# EAGLE design twip-mb4 (EAGLE 9.3.0)
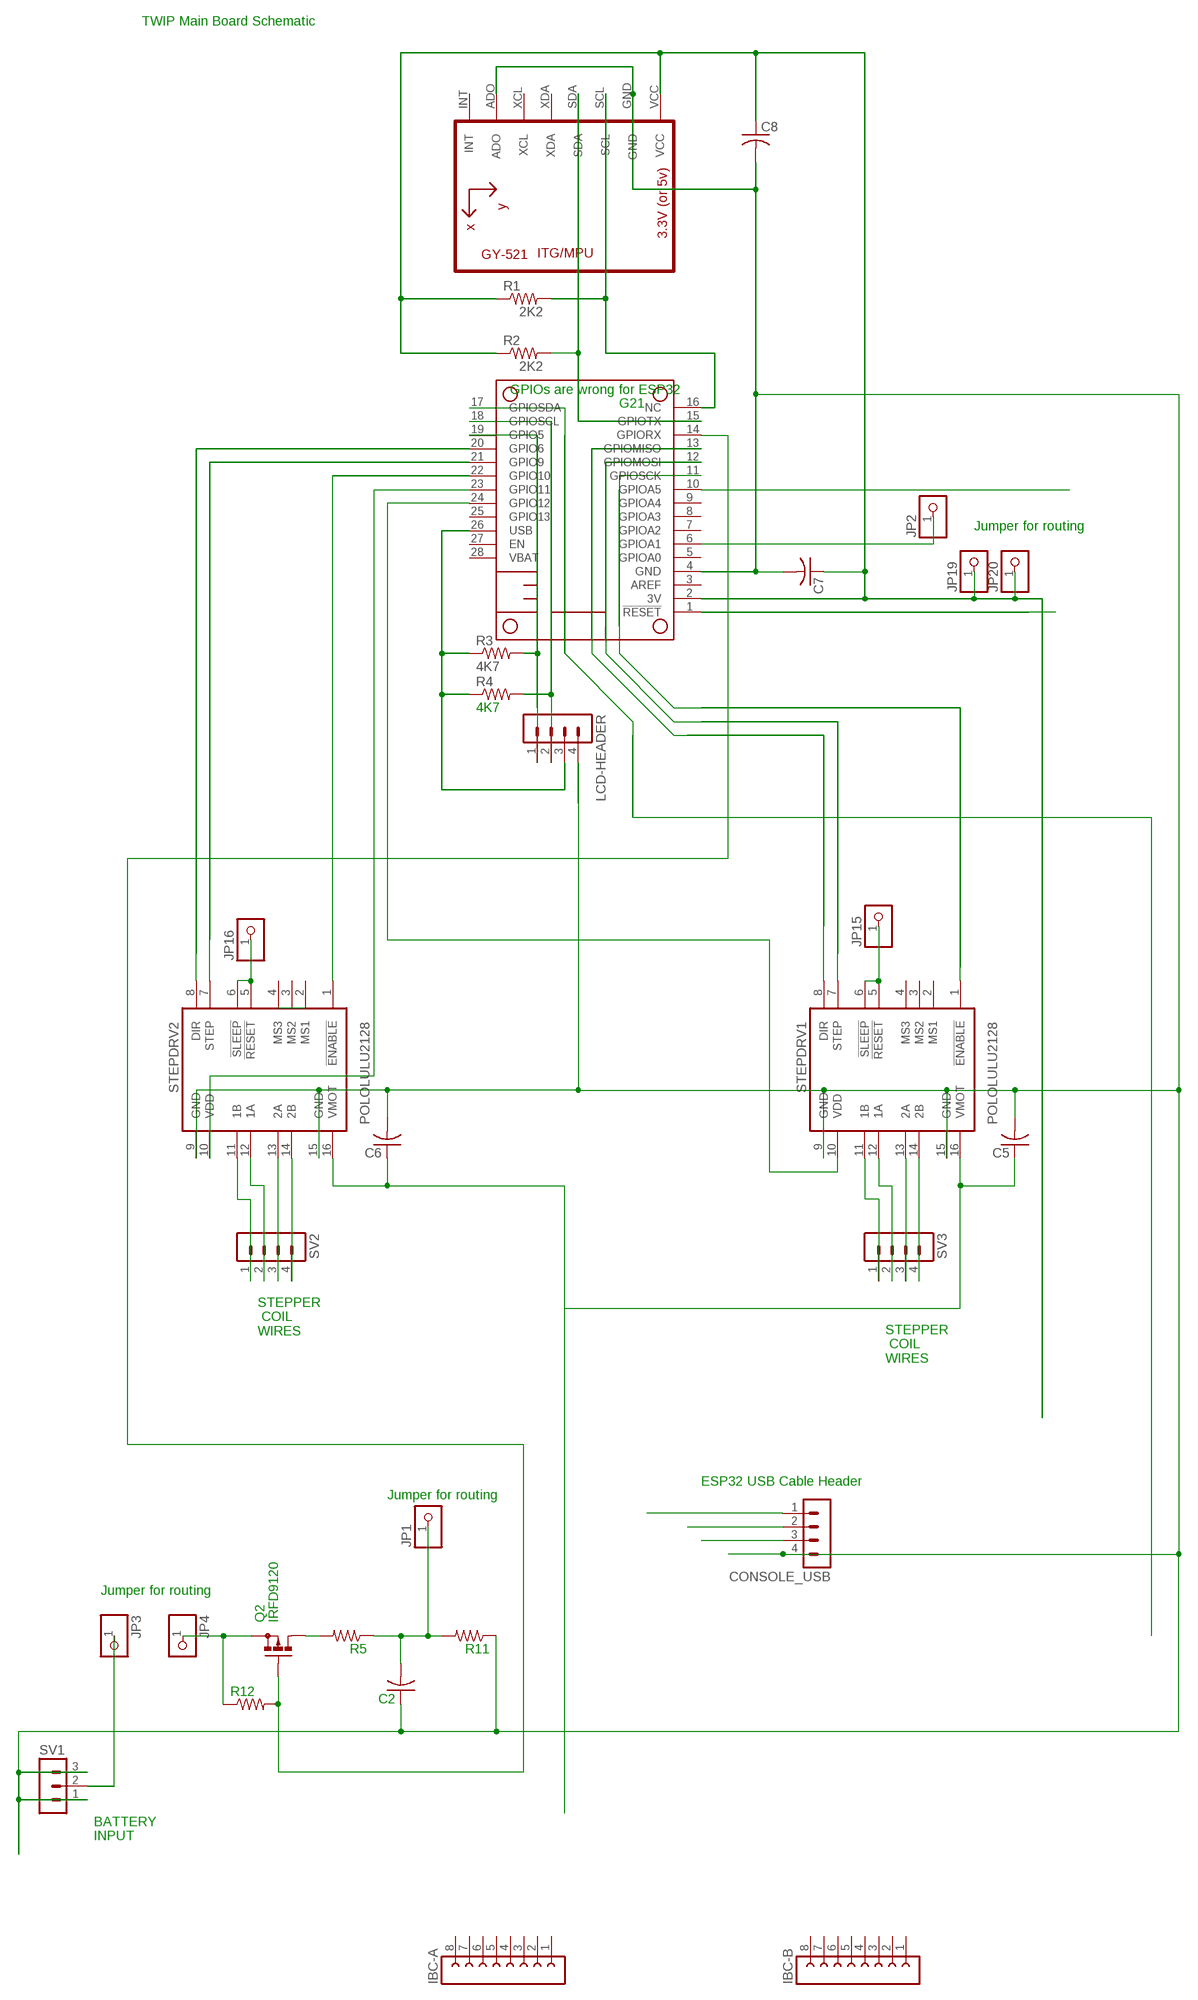
[diagram p0: schematic, sheet 1]

## Parts
C2  C-US050-025X075  [C050-025X075]
C5  C-US050-024X044  [C050-024X044]
C6  C-US050-024X044  [C050-024X044]
C7  C-US050-024X044  [C050-024X044]
C8  C-US050-024X044  [C050-024X044]
CONSOLE_USB  MA04-1  [MA04-1]
IBC-A  FE08-1  [FE08]
IBC-B  FE08-1  [FE08]
JP1  PINHD-1X1  [1X01]
JP2  PINHD-1X1  [1X01]
JP3  PINHD-1X1  [1X01]
JP4  PINHD-1X1  [1X01]
JP15  PINHD-1X1  [1X01]
JP16  PINHD-1X1  [1X01]
JP19  PINHD-1X1  [1X01]
JP20  PINHD-1X1  [1X01]
LCD-HEADER  MA04-1  [MA04-1]
MS2  FEATHERWING_NOHOLES  [FEATHERWING_NOHOLES]
Q2  IRFD9120  [C370-01]
R1  2K2  R-US_0309/12  [0309/12]
R2  2K2  R-US_0309/12  [0309/12]
R3  4K7  R-US_0309/12  [0309/12]
R4  4K7  R-US_0309/12  [0309/12]
R5  R-US_0207/10  [0207/10]
R11  R-US_0207/10  [0207/10]
R12  R-US_0207/10  [0207/10]
STEPDRV1  POLOLULU2128  [POLOLULU2128]
STEPDRV2  POLOLULU2128  [POLOLULU2128]
SV1  MA03-1  [MA03-1]
SV2  MA04-1  [MA04-1]
SV3  MA04-1  [MA04-1]
U1  GY-521MPU6050  [GY-521]

## Nets
3V: C7.1 C8.1 JP19.1 JP20.1 MS2.2(3V) R1.1 R2.1 U1.VCC
N$2: C5.1 STEPDRV1.16(VMOT)
N$3: MS2.13(GPIOMISO) STEPDRV1.8(DIR)
N$4: MS2.1(!RESET)
N$5: JP15.1 STEPDRV1.5(!RESET) STEPDRV1.6(!SLEEP)
N$6: MS2.14(GPIORX) Q2.G R12.2
N$7: JP16.1 STEPDRV2.5(!RESET) STEPDRV2.6(!SLEEP)
N$8: STEPDRV2.14(2B) SV2.4
N$9: C2.1 C5.2 C6.2 C7.2 C8.2 CONSOLE_USB.4 LCD-HEADER.4 MS2.4(GND) R11.1 STEPDRV1.9(GND) STEPDRV1.15(GND) STEPDRV2.9(GND) STEPDRV2.15(GND) SV1.1 SV1.3 U1.ADO U1.GND
N$11: LCD-HEADER.1 MS2.19(GPIO5) R3.2
N$12: STEPDRV2.13(2A) SV2.3
N$13: STEPDRV2.12(1A) SV2.2
N$14: STEPDRV2.11(1B) SV2.1
N$15: MS2.12(GPIOMOSI) STEPDRV1.7(STEP)
N$16: STEPDRV1.14(2B) SV3.4
N$17: MS2.16(NC) R1.2 U1.SCL
N$18: STEPDRV1.13(2A) SV3.3
N$19: STEPDRV1.12(1A) SV3.2
N$20: STEPDRV1.11(1B) SV3.1
N$21: MS2.11(GPIOSCK) STEPDRV1.1(!ENABLE)
N$22: CONSOLE_USB.2
N$23: CONSOLE_USB.3
N$24: JP4.1 Q2.S R12.1
N$25: MS2.15(GPIOTX) R2.2 U1.SDA
N$27: MS2.20(GPIO6) STEPDRV2.8(DIR)
N$28: MS2.17(GPIOSDA)
N$29: MS2.21(GPIO9) STEPDRV2.7(STEP)
N$30: C2.2 JP1.1 R5.1 R11.2
N$31: MS2.10(GPIOA5)
N$32: JP3.1 SV1.2
N$33: JP2.1 MS2.6(GPIOA1)
N$34: MS2.22(GPIO10) STEPDRV2.1(!ENABLE)
N$35: LCD-HEADER.2 MS2.18(GPIOSCL) R4.2
N$36: MS2.23(GPIO11) STEPDRV2.10(VDD)
N$37: MS2.24(GPIO12) STEPDRV1.10(VDD)
N$38: C6.1 STEPDRV2.16(VMOT)
N$48: CONSOLE_USB.1
N$51: Q2.D Q2.D1(D) R5.2
USB: LCD-HEADER.3 MS2.26(USB) R3.1 R4.1
Unconnected: IBC-A.1 IBC-A.2 IBC-A.3 IBC-A.4 IBC-A.5 IBC-A.6 IBC-A.7 IBC-A.8 IBC-B.1 IBC-B.2 IBC-B.3 IBC-B.4 IBC-B.5 IBC-B.6 IBC-B.7 IBC-B.8 MS2.3(AREF) MS2.5(GPIOA0) MS2.7(GPIOA2) MS2.8(GPIOA3) MS2.9(GPIOA4) MS2.25(GPIO13) MS2.27(EN) MS2.28(VBAT) STEPDRV1.2(MS1) STEPDRV1.3(MS2) STEPDRV1.4(MS3) STEPDRV2.2(MS1) STEPDRV2.3(MS2) STEPDRV2.4(MS3) U1.INT U1.XCL U1.XDA

## Notes on the sheet
- TWIP Main Board Schematic
- GPIOs are wrong for ESP32
- G21
- Jumper for routing
- STEPPER
   COIL
  WIRES
- STEPPER
   COIL
  WIRES
- ESP32 USB Cable Header
- Jumper for routing
- Jumper for routing
- BATTERY
  INPUT

## Library data of the parts
C2 C5-C8 = rcl:C-US: CAPACITOR, American symbol; SPICEPREFIX: C
CONSOLE_USB LCD-HEADER SV2 SV3 = con-lstb:MA04-1: PIN HEADER; OC_FARNELL: unknown; OC_NEWARK: unknown
IBC-A IBC-B = con-lsta:FE08-1: FEMALE HEADER; OC_FARNELL: unknown; OC_NEWARK: unknown
JP1-JP4 JP15 JP16 JP19 JP20 = pinhead:PINHD-1X1: PIN HEADER
MS2 = microbuilder:FEATHERWING
Q2 = transistor-small-signal:IRFD9120: P-CHANNEL MOS FET
R1-R4 = resistor:R-US_: RESISTOR, American symbol
R5 R11 R12 = rcl:R-US_: RESISTOR, American symbol; SPICEPREFIX: R
STEPDRV1 STEPDRV2 = stepper_drivers_etc:POLOLULU2128
SV1 = con-lstb:MA03-1: PIN HEADER; OC_FARNELL: unknown; OC_NEWARK: unknown
U1 = gy-521:GY-521

## Board
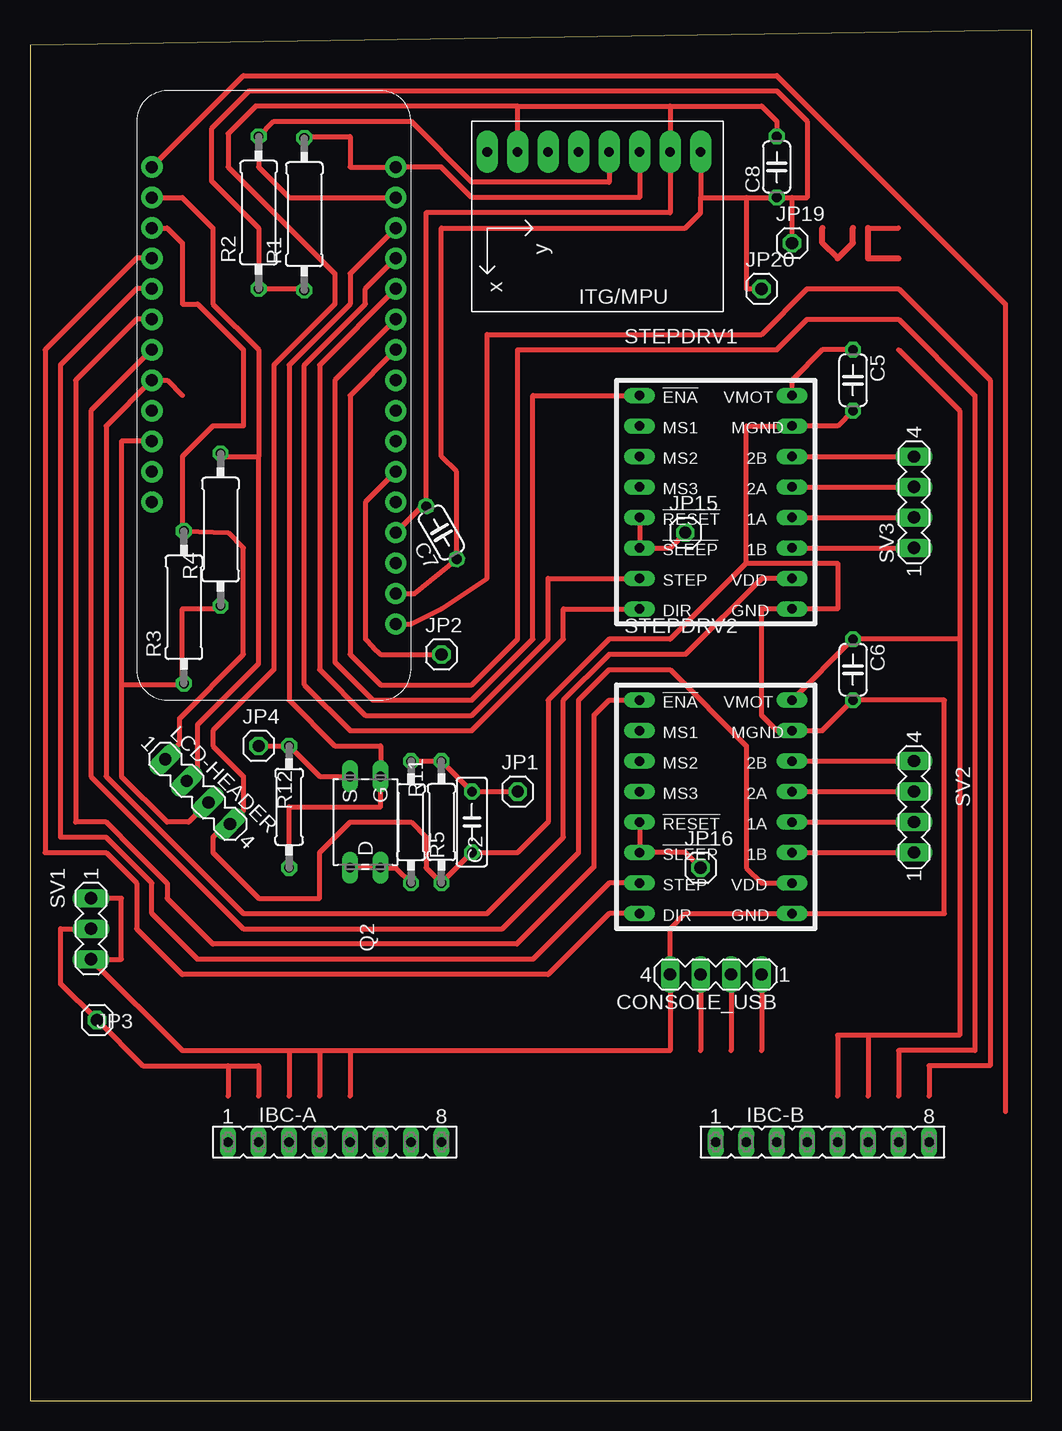
[diagram p1: board, top side]

Size 83.49 x 114.29 mm. Coordinates in mm from the lower left corner, seen from the top.
Outline: 0,0 83.49,0 83.49,114.29 0,113.02 0,0
Copper layers (1*16): Top 0.035mm / dielectric 1.5mm / Bottom 0.035mm
Design rules "default *": minimum track width 16mil, minimum drill 0.35mm, track to track 6mil, track to pad 6mil, pad to pad 6mil, via to via 6mil, smd to smd 6mil, copper to edge 40mil, drill to drill 6mil, minimum pad ring 10mil, minimum via ring 8mil, stop-mask expansion 4mil, vias tented up to drill 0mil, thermal gap 10mil

### Footprints (pad centres in the part's own frame; a part is rotated, then mirrored left to right if it is on the bottom)
C050-025X075 = drill 0.813 octagon: 1 -2.54,0; 2 2.54,0
C050-024X044 = drill 0.813 octagon: 1 -2.54,0; 2 2.54,0
MA04-1 = drill 1.016 long: 1 -3.81,0; 2 -1.27,0; 3 1.27,0; 4 3.81,0
FE08 = drill 0.813 long: 1 -8.89,0; 2 -6.35,0; 3 -3.81,0; 4 -1.27,0; 5 1.27,0; 6 3.81,0; 7 6.35,0; 8 8.89,0
1X01 = drill 1.016 octagon: 1 0,0
FEATHERWING_NOHOLES = drill 1 pad 1.778: 1 6.35,1.27; 2 8.89,1.27; 3 11.43,1.27; 4 13.97,1.27; 5 16.51,1.27; 6 19.05,1.27; 7 21.59,1.27; 8 24.13,1.27; 9 26.67,1.27; 10 29.21,1.27; 11 31.75,1.27; 12 34.29,1.27; 13 36.83,1.27; 14 39.37,1.27; 15 41.91,1.27; 16 44.45,1.27; 17 44.45,21.59; 18 41.91,21.59; 19 39.37,21.59; 20 36.83,21.59; 21 34.29,21.59; 22 31.75,21.59; 23 29.21,21.59; 24 26.67,21.59; 25 24.13,21.59; 26 21.59,21.59; 27 19.05,21.59; 28 16.51,21.59
C370-01 = drill 0.813 long: D -3.81,1.27; D1 -3.81,-1.27; G 3.81,-1.27; S 3.81,1.27
0309/12 = drill 0.813 octagon: 1 -6.35,0; 2 6.35,0
0207/10 = drill 0.813 octagon: 1 -5.08,0; 2 5.08,0
POLOLULU2128 = drill 0.8 long: 1 -7.62,7.62; 2 -7.62,5.08; 3 -7.62,2.54; 4 -7.62,0; 5 -7.62,-2.54; 6 -7.62,-5.08; 7 -7.62,-7.62; 8 -7.62,-10.16; 9 5.08,-10.16; 10 5.08,-7.62; 11 5.08,-5.08; 12 5.08,-2.54; 13 5.08,0; 14 5.08,2.54; 15 5.08,5.08; 16 5.08,7.62
MA03-1 = drill 1.016 long: 1 -2.54,0; 2 0,0; 3 2.54,0
GY-521 = drill 0.8 pad 1.778 long: ADO -8.89,-6.35; GND -8.89,6.35; INT -8.89,-8.89; SCL -8.89,3.81; SDA -8.89,1.27; VCC -8.89,8.89; XCL -8.89,-3.81; XDA -8.89,-1.27

### Placement (x,y rotation side)
C2  36.83,48.26 90 top
C5  68.58,85.09 270 top
C6  68.58,60.96 270 top
C7  34.29,72.39 120 top
C8  62.23,102.87 90 top
CONSOLE_USB  57.15,35.56 180 top
IBC-A  25.4,21.59 0 top
IBC-B  66.04,21.59 0 top
JP1  40.64,50.8 0 top
JP2  34.29,62.23 0 top
JP3  5.59,31.75 0 top
JP4  19.05,54.61 0 top
JP15  54.61,72.39 0 top
JP16  55.88,44.45 0 top
JP19  63.5,96.52 0 top
JP20  60.96,92.71 0 top
LCD-HEADER  13.97,50.8 315 top
MS2  31.75,58.42 90 top
Q2  27.94,48.26 90 top
R1  22.86,98.93 90 top
R2  19.05,99.06 90 top
R3  12.83,66.17 90 top
R4  15.88,72.64 90 top
R5  31.75,48.26 270 top
R11  34.29,48.26 90 top
R12  21.59,49.53 270 top
STEPDRV1  58.42,76.2 0 top
STEPDRV2  58.42,50.8 0 top
SV1  5.08,39.37 270 top
SV2  73.66,49.53 90 top
SV3  73.66,74.93 90 top
U1  46.99,95.25 270 top

### Tracks (layer width: path | path; a pad name or v marks a point on that pad's centre or on a via)
3V
  Top 0.406: U1.VCC 55.88,100.33 | 55.88,100.33 59.69,100.33 | C8.1 63.5,100.33 JP19.1 | 59.69,100.33 C8.1 | C8.1 64.77,100.33 64.77,106.68 62.23,109.22 18.29,109.22 15.11,106.05 15.11,101.73 19.05,97.79 R2.1 22.86,92.71 R1.1 | MS2.2 32.03,67.31 C7.1 35.56,77.47 34.29,78.74 34.29,97.79 54.61,97.79 55.88,99.06 55.88,100.33 | 59.69,100.33 59.69,92.71 JP20.1
N$1
  Top 0.508: 68.58,97.79 68.58,96.52 67.31,95.25 66.04,96.52 66.04,97.79
N$2
  Top 0.406: C5.1 66.04,87.63 63.5,85.09 STEPDRV1.16
N$3
  Top 0.406: MS2.13 27.94,92.71 27.94,91.44 22.86,86.36 22.86,59.69 26.67,55.88 36.83,55.88 44.45,63.5 44.45,66.04 STEPDRV1.8
N$4
  Top 0.406: MS2.1 31.75,64.77 34.29,66.04 38.1,68.58 38.1,88.9 60.96,88.9 64.77,92.71 72.39,92.71 80.01,85.09 80.01,27.94 74.93,27.94 74.93,25.4
N$5
  Top 0.406: STEPDRV1.5 STEPDRV1.6 53.34,71.12 JP15.1
N$6
  Top 0.406: MS2.14 26.67,93.98 26.67,91.44 21.59,86.36 21.59,58.42 25.4,54.61 29.21,54.61 Q2.G 29.21,49.53 21.59,49.53 R12.2
N$7
  Top 0.406: STEPDRV2.5 STEPDRV2.6 54.61,45.72 JP16.1
N$8
  Top 0.406: STEPDRV2.14 SV2.4
N$9
  Top 0.406: C5.2 67.31,81.28 STEPDRV1.15 59.69,81.28 59.69,69.85 | SV1.1 7.62,41.91 7.62,36.83 SV1.3 12.7,29.21 21.59,29.21 | 21.59,29.21 24.13,29.21 | 24.13,29.21 24.13,25.4 | 21.59,29.21 21.59,25.4 | 26.67,29.21 26.67,25.4 | C8.2 62.23,106.68 60.96,107.95 53.34,107.95 | 53.34,107.95 U1.GND 53.34,99.06 33.02,99.06 33.02,74.93 | U1.ADO 40.64,107.95 | 40.64,107.95 53.34,107.95 | MS2.4 33.02,74.93 | C7.2 33.02,74.93 | 40.64,107.95 18.8,107.95 16.51,105.66 16.51,102.87 25.4,93.98 25.4,91.44 20.32,86.36 20.32,60.96 15.24,55.88 15.24,54.61 17.78,52.07 17.78,49.22 LCD-HEADER.4 16.36,48.11 15.24,46.99 15.24,45.72 19.05,41.91 24.13,41.91 24.13,45.72 26.67,48.26 31.75,48.26 33.02,46.99 33.02,44.45 R11.1 C2.1 40.64,45.72 43.18,48.26 43.18,58.42 48.26,63.5 53.34,63.5 59.69,69.85 | 24.13,29.21 26.67,29.21 | 26.67,29.21 53.34,29.21 CONSOLE_USB.4 53.34,39.37 54.61,40.64 STEPDRV2.9 76.2,40.64 76.2,58.42 C6.2 66.04,55.88 STEPDRV2.15 62.23,55.88 60.96,57.15 60.96,66.04 STEPDRV1.9 67.31,66.04 67.31,69.85 59.69,69.85
N$11
  Top 0.406: MS2.19 11.43,97.79 12.7,96.52 12.7,91.44 13.97,91.44 17.78,87.63 17.78,81.28 15.24,81.28 12.7,78.74 12.7,72.74 R3.2 16.51,72.39 17.78,71.12 17.78,62.23 12.46,56.91 12.46,54.82 LCD-HEADER.1
N$12
  Top 0.406: STEPDRV2.13 SV2.3
N$13
  Top 0.406: STEPDRV2.12 SV2.2
N$14
  Top 0.406: STEPDRV2.11 SV2.1
N$15
  Top 0.406: MS2.12 24.13,86.36 24.13,60.96 27.94,57.15 36.83,57.15 43.18,63.5 43.18,68.58 STEPDRV1.7
N$16
  Top 0.406: STEPDRV1.14 SV3.4
N$17
  Top 0.406: U1.SCL 50.8,100.33 36.83,100.33 34.29,102.87 MS2.16 26.67,102.87 26.67,105.41 22.99,105.41 R1.2
N$18
  Top 0.406: STEPDRV1.13 SV3.3
N$19
  Top 0.406: STEPDRV1.12 SV3.2
N$20
  Top 0.406: STEPDRV1.11 SV3.1
N$21
  Top 0.406: STEPDRV1.1 41.91,83.82 41.91,63.5 36.83,58.42 28.57,58.42 25.4,61.59 25.4,85.09 MS2.11
N$22
  Top 0.406: CONSOLE_USB.2 58.42,29.21
N$23
  Top 0.406: CONSOLE_USB.3 55.88,29.21
N$24
  Top 0.406: JP4.1 R12.1 24.13,52.07 Q2.S 26.19,52.07
N$25
  Top 0.406: U1.SDA 48.26,101.6 36.83,101.6 31.75,106.68 20.32,106.68 R2.2 19.05,102.87 21.59,100.33 MS2.15
N$26
  Top 0.406: 69.85,97.79 72.39,97.79
  Top 0.508: 69.85,97.79 69.85,95.25 72.39,95.25
N$27
  Top 0.406: STEPDRV2.8 48.26,40.64 43.18,35.56 12.7,35.56 8.89,39.37 8.89,43.18 6.35,45.72 1.27,45.72 1.27,87.63 8.89,95.25 MS2.20
N$28
  Top 0.406: 81.28,24.13 81.28,91.44 62.23,110.49 17.78,110.49 MS2.17
N$29
  Top 0.406: STEPDRV2.7 48.26,43.18 41.91,36.83 13.97,36.83 10.16,40.64 10.16,43.18 6.35,46.99 2.54,46.99 2.54,86.36 8.89,92.71 MS2.21
N$30
  Top 0.406: R5.1 R11.2 C2.2 JP1.1
N$31
  Top 0.406: MS2.10 26.67,83.82 26.67,62.23 29.21,59.69 36.83,59.69 40.64,63.5 40.64,87.63 62.23,87.63 64.77,90.17 72.39,90.17 78.74,83.82 78.74,29.21 72.39,29.21 72.39,25.4
N$32
  Top 0.406: SV1.2 2.54,39.37 2.54,34.8 JP3.1 9.4,27.94 16.51,27.94 | 16.51,27.94 19.05,27.94 19.05,25.4 | 16.51,27.94 16.51,25.4
N$33
  Top 0.406: MS2.6 27.94,74.93 27.94,63.5 28.57,62.87 29.21,62.23 JP2.1
N$34
  Top 0.406: STEPDRV2.1 48.26,58.42 46.99,57.15 46.99,44.51 40.58,38.1 15.24,38.1 11.43,41.91 11.43,43.18 11.4,43.18 7.61,46.98 7.61,47 6.35,48.26 3.81,48.26 3.81,85.09 8.89,90.17 MS2.22
N$35
  Top 0.406: MS2.18 12.7,100.33 15.24,97.79 15.24,91.44 19.05,87.63 19.05,78.74 | 19.05,78.74 19.05,61.47 13.97,56.39 13.97,52.6 LCD-HEADER.2 | R4.2 16.13,78.74 19.05,78.74
N$36
  Top 0.406: MS2.23 5.08,82.55 5.08,52.07 17.78,39.37 39.37,39.37 45.72,45.72 45.72,58.42 48.26,60.96 53.34,60.96 59.69,54.61 59.69,44.45 60.96,43.18 STEPDRV2.10
N$37
  Top 0.406: 12.7,83.82 11.43,85.09 MS2.24 6.35,81.28 6.35,52.07 17.78,40.64 38.1,40.64 44.45,46.99 44.45,58.42 48.26,62.23 54.61,62.23 60.96,68.58 STEPDRV1.10
N$38
  Top 0.406: STEPDRV2.16 C6.1 77.47,63.5 | 77.47,63.5 77.47,82.55 72.39,87.63 | 69.85,30.48 77.47,30.48 77.47,63.5 | 69.85,30.48 67.31,30.48 67.31,25.4 | 69.85,30.48 69.85,25.4
N$48
  Top 0.406: CONSOLE_USB.1 60.96,29.21
N$51
  Top 0.406: Q2.D Q2.D1 30.48,44.45 R5.2
USB
  Top 0.406: LCD-HEADER.3 13.23,48.26 11.43,48.26 7.62,52.07 7.62,59.69 | MS2.26 7.62,80.01 7.62,59.69 | 7.62,59.69 12.7,59.69 R3.1 12.7,59.94 12.7,66.04 15.62,66.04 R4.1
(copper drawn outside any net)
  shapes: Top area x5